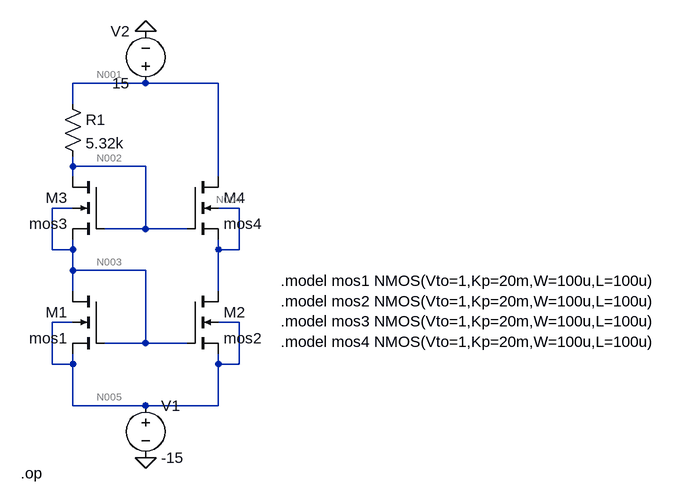
[diagram p0: schematic assignment.asc]
assignment.asc, the LTspice schematic file:
Version 4.1
SHEET 1 1088 696
WIRE 256 80 144 80
WIRE 368 80 256 80
WIRE 144 112 144 80
WIRE 144 208 144 192
WIRE 256 208 144 208
WIRE 144 224 144 208
WIRE 368 224 368 80
WIRE 144 272 112 272
WIRE 400 272 368 272
WIRE 256 304 256 208
WIRE 256 304 192 304
WIRE 320 304 256 304
WIRE 112 336 112 272
WIRE 144 336 144 320
WIRE 144 336 112 336
WIRE 368 336 368 320
WIRE 400 336 400 272
WIRE 400 336 368 336
WIRE 144 368 144 336
WIRE 256 368 144 368
WIRE 144 400 144 368
WIRE 368 400 368 336
WIRE 144 448 112 448
WIRE 400 448 368 448
WIRE 256 480 256 368
WIRE 256 480 192 480
WIRE 320 480 256 480
WIRE 112 512 112 448
WIRE 144 512 144 496
WIRE 144 512 112 512
WIRE 368 512 368 496
WIRE 400 512 400 448
WIRE 400 512 368 512
WIRE 144 576 144 512
WIRE 256 576 144 576
WIRE 368 576 368 512
WIRE 368 576 256 576
FLAG 256 656 0
FLAG 256 0 0
SYMBOL res 128 96 R0
SYMATTR InstName R1
SYMATTR Value 5.32k
SYMBOL nmos4 192 224 M0
SYMATTR InstName M3
SYMATTR Value mos3
SYMBOL nmos4 320 224 R0
SYMATTR InstName M4
SYMATTR Value mos4
SYMBOL nmos4 192 400 M0
SYMATTR InstName M1
SYMATTR Value mos1
SYMBOL nmos4 320 400 R0
SYMATTR InstName M2
SYMATTR Value mos2
SYMBOL voltage 256 560 R0
WINDOW 123 0 0 Left 0
WINDOW 39 0 0 Left 0
SYMATTR InstName V1
SYMATTR Value -15
SYMBOL voltage 256 96 R180
WINDOW 0 24 96 Left 2
WINDOW 3 24 16 Left 2
WINDOW 123 0 0 Left 0
WINDOW 39 0 0 Left 0
SYMATTR InstName V2
SYMATTR Value 15
TEXT 464 384 Left 2 !.model mos1 NMOS(Vto=1,Kp=20m,W=100u,L=100u)\n.model mos2 NMOS(Vto=1,Kp=20m,W=100u,L=100u)\n.model mos3 NMOS(Vto=1,Kp=20m,W=100u,L=100u)\n.model mos4 NMOS(Vto=1,Kp=20m,W=100u,L=100u)
TEXT 64 680 Left 2 !.op

The netlist it stands for:
* assignment.asc
R1 N001 N002 5.32k
M3 N002 N002 N003 N003 mos3
M4 N001 N002 N004 N004 mos4
M1 N003 N003 N005 N005 mos1
M2 N004 N003 N005 N005 mos2
V1 N005 0 -15
V2 N001 0 15
.model NMOS NMOS
.model PMOS PMOS
.lib standard.mos
.model mos1 NMOS(Vto=1,Kp=20m,W=100u,L=100u)
.model mos2 NMOS(Vto=1,Kp=20m,W=100u,L=100u)
.model mos3 NMOS(Vto=1,Kp=20m,W=100u,L=100u)
.model mos4 NMOS(Vto=1,Kp=20m,W=100u,L=100u)
.op
.backanno
.end

* Results of the author's LTspice run, read from the files saved beside the schematic
* Operating Point:
*   V(n002) = -11.59 V
*   V(n004) = -13.29 V
*   V(n005) = -15 V
*   V(n001) = 15 V
*   V(n003) = -13.29 V
*   Id(M4) = 4.998 mA
*   Ig(M4) = 0 A
*   Is(M4) = -4.998 mA
*   Ib(M4) = -28.3 pA
*   I(V1) = 9.995 mA
*   I(R1) = 4.997 mA
*   Id(M2) = 4.998 mA
*   Ig(M2) = 0 A
*   Is(M2) = -4.998 mA
*   Ib(M2) = -1.717 pA
*   Id(M1) = 4.998 mA
*   Ig(M1) = 0 A
*   Is(M1) = -4.998 mA
*   Ib(M1) = -1.717 pA
*   Id(M3) = 4.998 mA
*   Ig(M3) = 0 A
*   Is(M3) = -4.998 mA
*   Ib(M3) = -1.717 pA
*   I(V2) = -9.995 mA
* From the log:
*   Semiconductor Device Operating Points:
*                           --- MOSFET Transistors ---
*   Name:           M1          M2          M3          M4
*   Model:         mos1        mos2        mos3        mos4
*   Id:          5.00e-03    5.00e-03    5.00e-03    5.00e-03
*   Vgs:         1.71e+00    1.71e+00    1.71e+00    1.71e+00
*   Vds:         1.71e+00    1.71e+00    1.71e+00    2.83e+01
*   Vbs:         0.00e+00    0.00e+00    0.00e+00    0.00e+00
*   Vth:         1.00e+00    1.00e+00    1.00e+00    1.00e+00
*   Vdsat:       7.07e-01    7.07e-01    7.07e-01    7.07e-01
*   Gm:          1.41e-02    1.41e-02    1.41e-02    1.41e-02
*   Gds:         0.00e+00    0.00e+00    0.00e+00    0.00e+00
*   Gmb:         0.00e+00    0.00e+00    0.00e+00    0.00e+00
*   Cbd:         0.00e+00    0.00e+00    0.00e+00    0.00e+00
*   Cbs:         0.00e+00    0.00e+00    0.00e+00    0.00e+00
*   Cgsov:       0.00e+00    0.00e+00    0.00e+00    0.00e+00
*   Cgdov:       0.00e+00    0.00e+00    0.00e+00    0.00e+00
*   Cgbov:       0.00e+00    0.00e+00    0.00e+00    0.00e+00
*   Cgs:         0.00e+00    0.00e+00    0.00e+00    0.00e+00
*   Cgd:         0.00e+00    0.00e+00    0.00e+00    0.00e+00
*   Cgb:         0.00e+00    0.00e+00    0.00e+00    0.00e+00